# EAGLE board trig3_board_de0-nano_rack (EAGLE 9.6.2), part 1 of 2
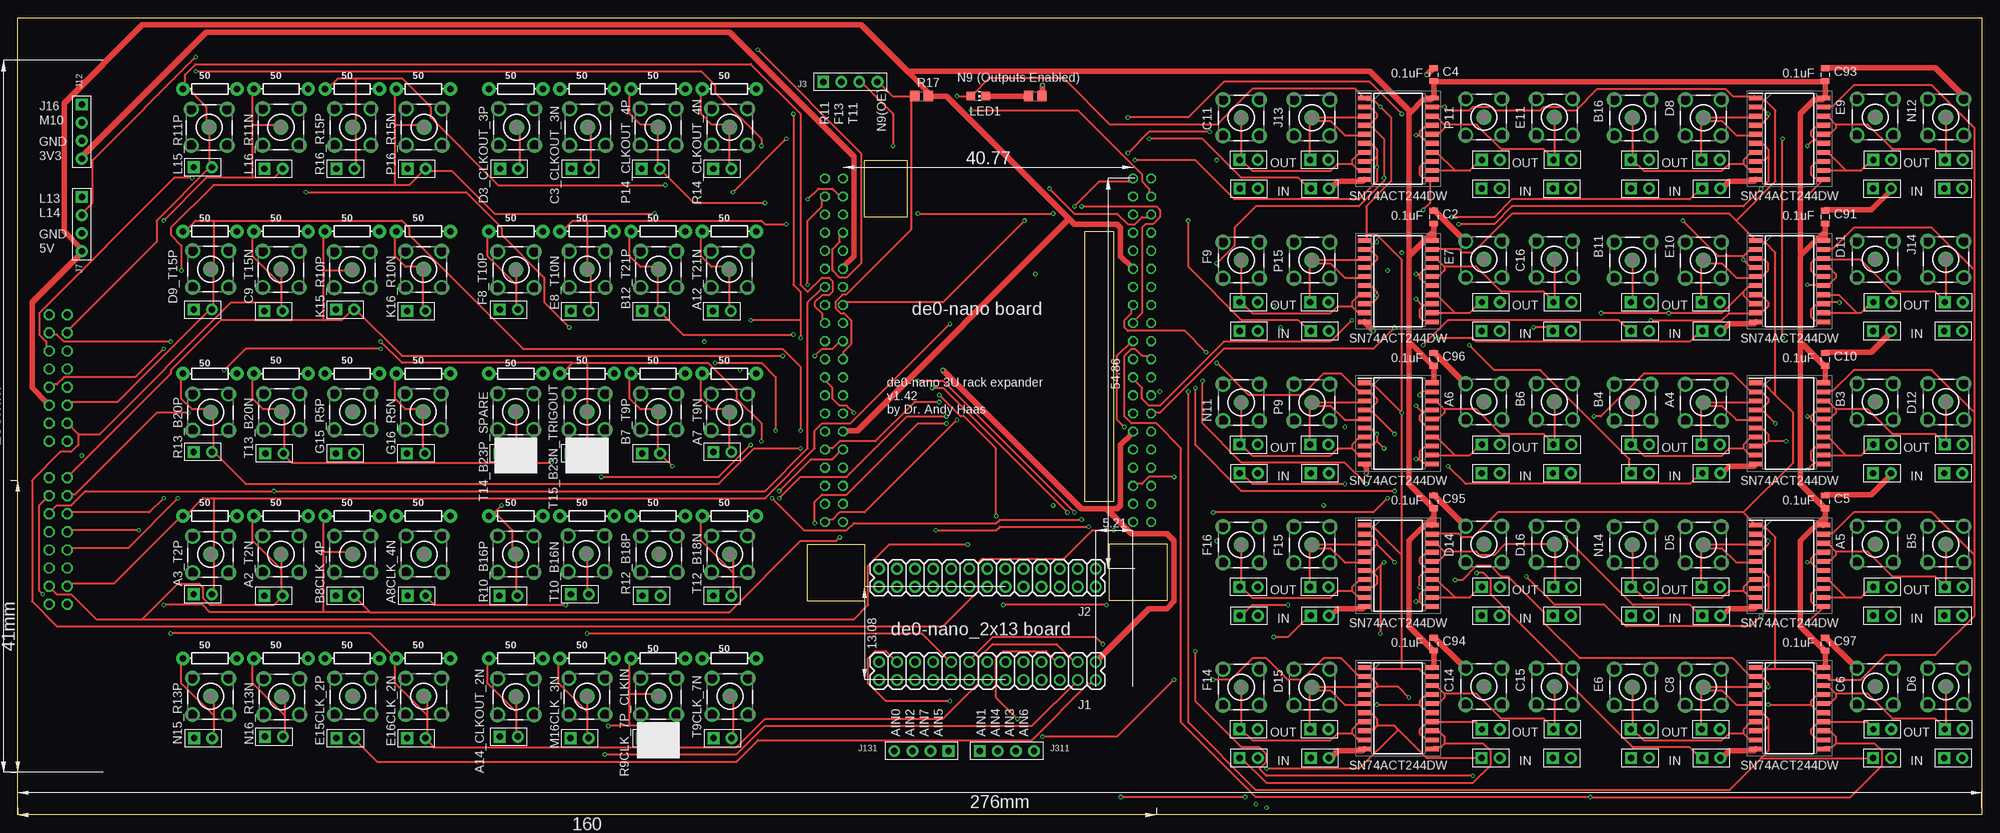
[diagram p3: board, top side]
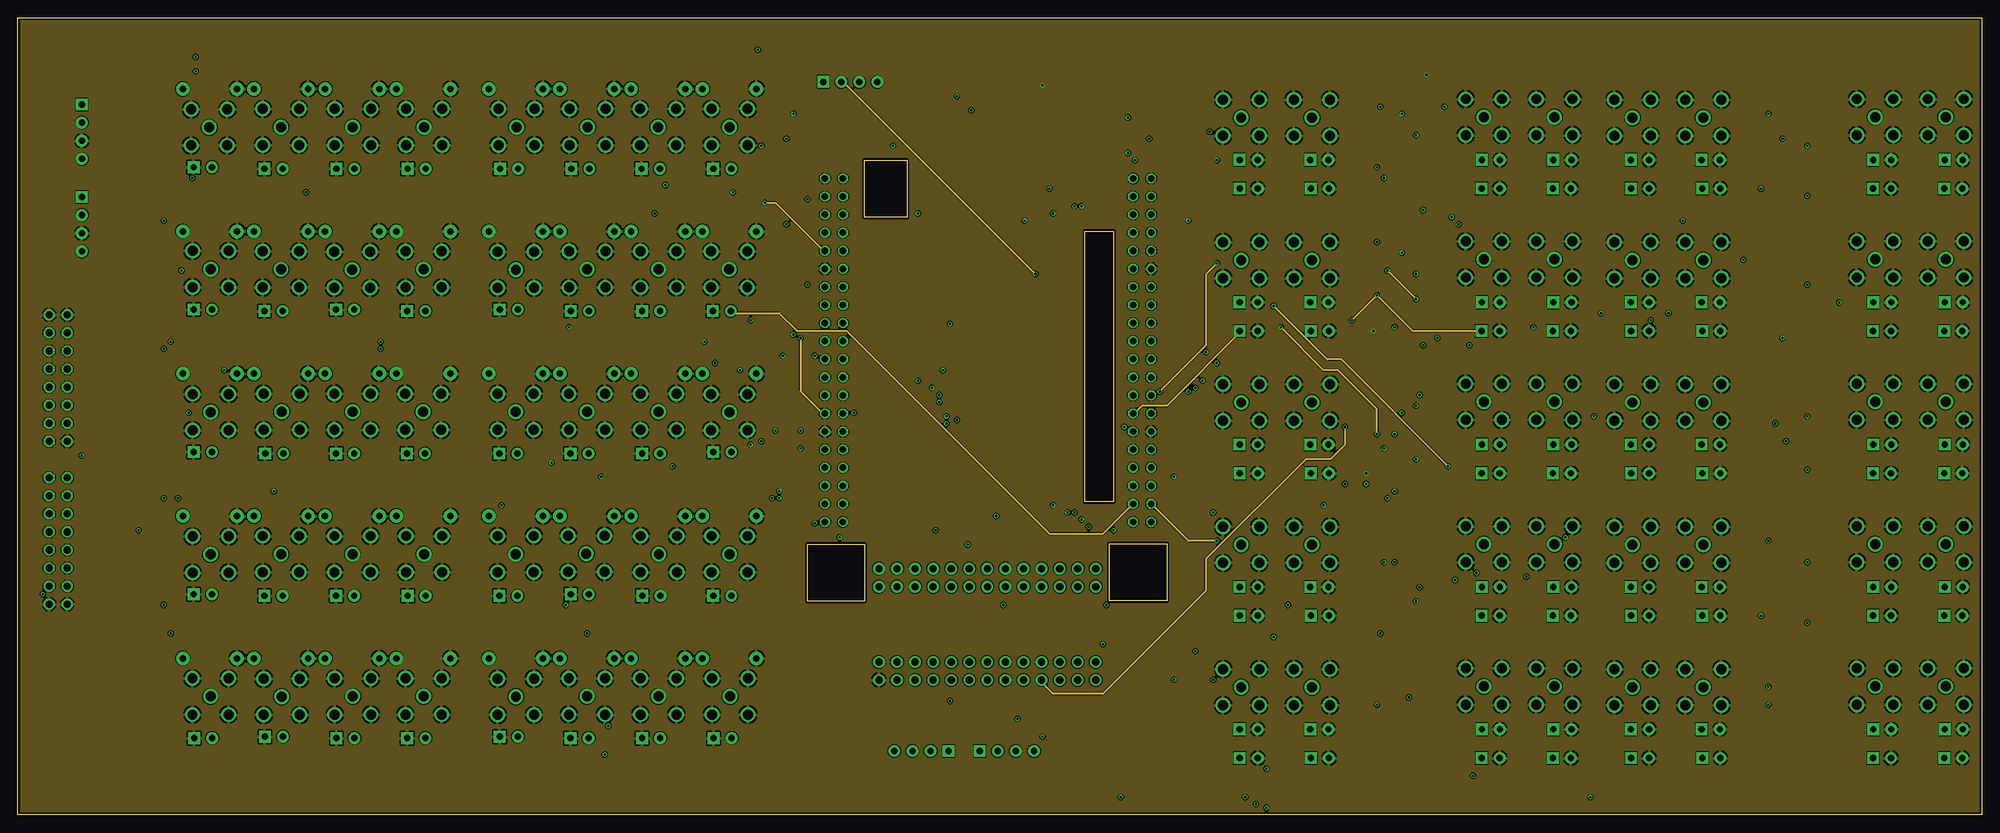
[diagram p4: board, inner layer Route2]
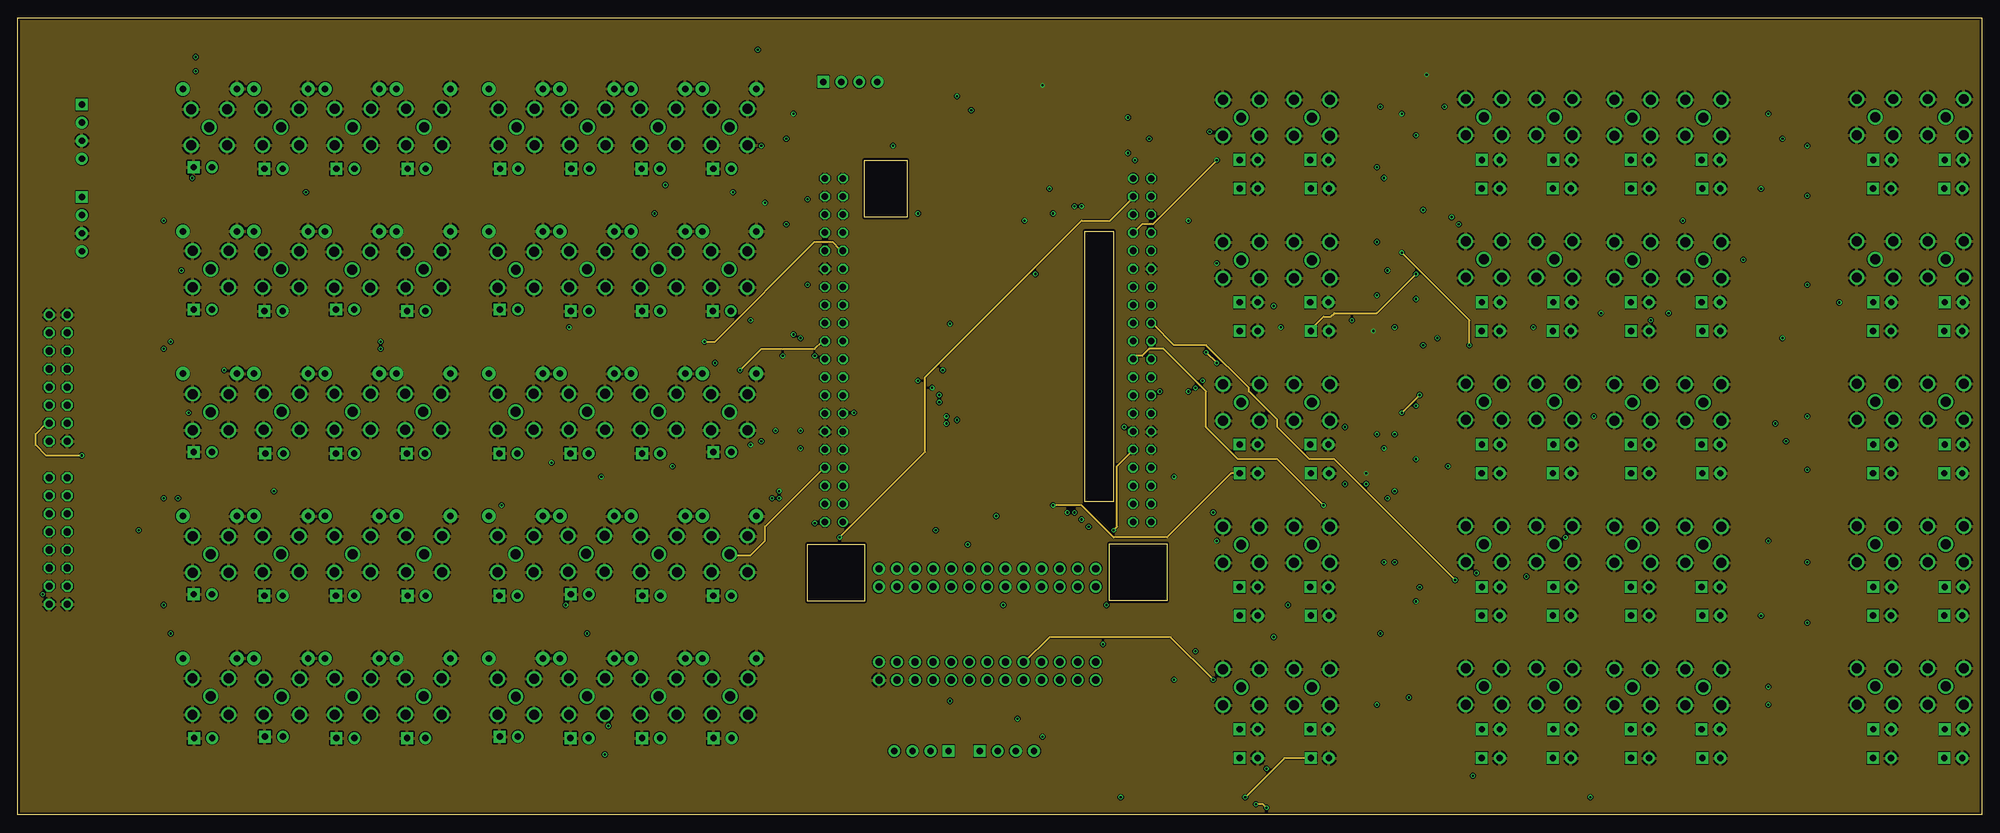
[diagram p5: board, inner layer Route15]
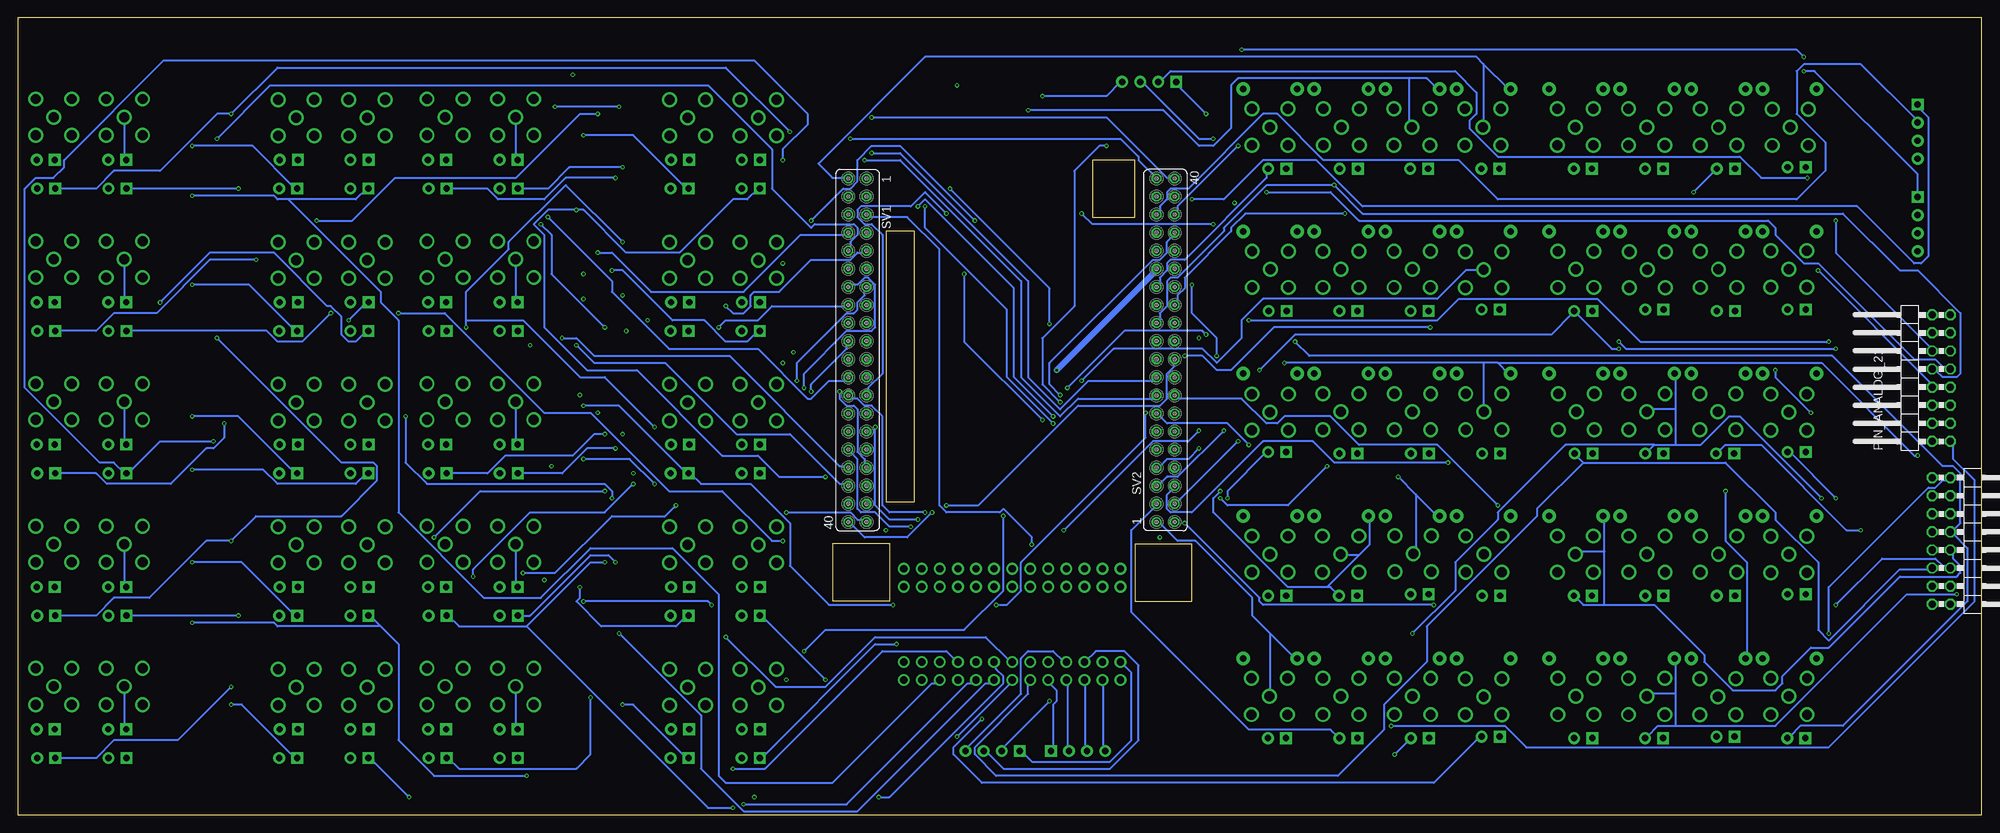
[diagram p6: board, bottom side, seen from below]

Size 276 x 112 mm. Coordinates in mm from the lower left corner, seen from the top.
Outline: 161.5,38.1 161.5,30.1 153.4,30.1 153.4,38.1 161.5,38.1
Outline: 119,38 119,30 111,30 111,38 119,38
Outline: 154,82 154,44 150,44 150,82 154,82
Outline: 119,84 119,92 125,92 125,84 119,84
Outline: 0,0 0,112 276,112 276,0 0,0
Copper layers (1*2*15*16): Top 0.035mm / dielectric 0.23mm / Route2 0.035mm / dielectric 0.93mm / Route15 0.035mm / dielectric 0.23mm / Bottom 0.035mm
Design rules "MF_Standard_4_Layer": minimum track width 5mil, minimum drill 12mil, track to track 5mil, track to pad 5mil, pad to pad 5mil, via to via 5mil, smd to smd 0mil, copper to edge 10mil, drill to drill 10mil, minimum pad ring 6mil, minimum via ring 6mil, stop-mask expansion 2mil, vias tented up to drill 25mil, thermal gap 10mil
Net classes: 0 default: width 0.254 mm; 1 power: width 0.762 mm; 3 five: width 0.381 mm; 4 50ohm: width 0.254 mm, clearance 0.254 mm to class 0, clearance 0.254 mm to class 1, clearance 0.254 mm to class 2, clearance 0.254 mm to class 3, clearance 0.254 mm

## Footprints (pad centres in the part's own frame; a part is rotated, then mirrored left to right if it is on the bottom)
BU-SMB-V = drill 1.4: 1 0,0; 2 -2.54,2.54; 3 2.54,2.54; 4 2.54,-2.54; 5 -2.54,-2.54
0805 = smd 0.8 x 1.2: 1 -0.9,0; 2 0.9,0
2X13 = drill 1.016 pad 1.651: 1 0,0; 2 0,2.54; 3 2.54,0; 4 2.54,2.54; 5 5.08,0; 6 5.08,2.54; 7 7.62,0; 8 7.62,2.54; 9 10.16,0; 10 10.16,2.54; 11 12.7,0; 12 12.7,2.54; 13 15.24,0; 14 15.24,2.54; 15 17.78,0; 16 17.78,2.54; 17 20.32,0; 18 20.32,2.54; 19 22.86,0; 20 22.86,2.54; 21 25.4,0; 22 25.4,2.54; 23 27.94,0; 24 27.94,2.54; 25 30.48,0; 26 30.48,2.54
H4-2.54 = drill 0.889 pad 1.651 square: 1 0,3.81 | drill 0.889 pad 1.651: 2 0,1.27; 3 0,-1.27; 4 0,-3.81
H2-2.54 = drill 0.889 pad 1.651 square: 1 0,1.27 | drill 0.889 pad 1.651: 2 0,-1.27
CHIP-LED0805 = smd 1.2 x 1.2: A 0,-1.05; C 0,1.05
2X08/90 = drill 1.016 octagon: 1 -8.89,-6.35; 2 -8.89,-3.81; 3 -6.35,-6.35; 4 -6.35,-3.81; 5 -3.81,-6.35; 6 -3.81,-3.81; 7 -1.27,-6.35; 8 -1.27,-3.81; 9 1.27,-6.35; 10 1.27,-3.81; 11 3.81,-6.35; 12 3.81,-3.81; 13 6.35,-6.35; 14 6.35,-3.81; 15 8.89,-6.35; 16 8.89,-3.81
AXIAL-0.3 = drill 0.9 pad 1.88: P$1 -3.81,0; P$2 3.81,0
R0805 = smd 1.3 x 1.5: 1 -0.95,0; 2 0.95,0
FE20-2 = drill 0.914: 1 -24.13,1.27 | drill 0.914 octagon: 2 -24.13,-1.27; 3 -21.59,1.27; 4 -21.59,-1.27; 5 -19.05,1.27; 6 -19.05,-1.27; 7 -16.51,1.27; 8 -16.51,-1.27; 9 -13.97,1.27; 10 -13.97,-1.27; 11 -11.43,1.27; 12 -11.43,-1.27; 13 -8.89,1.27; 14 -8.89,-1.27; 15 -6.35,1.27; 16 -6.35,-1.27; 17 -3.81,1.27; 18 -3.81,-1.27; 19 -1.27,1.27; 20 -1.27,-1.27; 21 1.27,1.27; 22 1.27,-1.27; 23 3.81,1.27; 24 3.81,-1.27; 25 6.35,1.27; 26 6.35,-1.27; 27 8.89,1.27; 28 8.89,-1.27; 29 11.43,1.27; 30 11.43,-1.27; 31 13.97,1.27; 32 13.97,-1.27; 33 16.51,1.27; 34 16.51,-1.27; 35 19.05,1.27; 36 19.05,-1.27; 37 21.59,1.27; 38 21.59,-1.27; 39 24.13,1.27; 40 24.13,-1.27
SOIC127P1030X265-20N = smd 1.95 x 0.65: 1 -4.725,5.715; 2 -4.725,4.445; 3 -4.725,3.175; 4 -4.725,1.905; 5 -4.725,0.635; 6 -4.725,-0.635; 7 -4.725,-1.905; 8 -4.725,-3.175; 9 -4.725,-4.445; 10 -4.725,-5.715; 11 4.725,-5.715; 12 4.725,-4.445; 13 4.725,-3.175; 14 4.725,-1.905; 15 4.725,-0.635; 16 4.725,0.635; 17 4.725,1.905; 18 4.725,3.175; 19 4.725,4.445; 20 4.725,5.715

## Placement (x,y rotation side)
A2_T2N  BU-SMB-V  [BU-SMB-V]  36.98,36.65 180 top
A3_T2P  BU-SMB-V  [BU-SMB-V]  27.1,36.6 180 top
A4  BU-SMB-V  [BU-SMB-V]  236.88,57.95 180 top
A5  BU-SMB-V  [BU-SMB-V]  261.02,38.05 0 top
A6  BU-SMB-V  [BU-SMB-V]  206.02,58.05 0 top
A7_T9N  BU-SMB-V  [BU-SMB-V]  100,56.6 180 top
A8CLK_4N  BU-SMB-V  [BU-SMB-V]  57.09,36.65 180 top
A12_T21N  BU-SMB-V  [BU-SMB-V]  99.98,76.65 180 top
A14_CLKOUT_2N  BU-SMB-V  [BU-SMB-V]  70,16.6 180 top
B3  BU-SMB-V  [BU-SMB-V]  261.02,58.05 0 top
B4  BU-SMB-V  [BU-SMB-V]  226.93,57.95 180 top
B5  BU-SMB-V  [BU-SMB-V]  270.96,38.05 0 top
B6  BU-SMB-V  [BU-SMB-V]  215.96,58.05 0 top
B7_T9P  BU-SMB-V  [BU-SMB-V]  90.04,56.65 180 top
B8CLK_4P  BU-SMB-V  [BU-SMB-V]  47.04,36.65 180 top
B11  BU-SMB-V  [BU-SMB-V]  226.93,77.95 180 top
B12_T21P  BU-SMB-V  [BU-SMB-V]  90.04,76.65 180 top
B16  BU-SMB-V  [BU-SMB-V]  226.93,97.95 180 top
C2  0.1uF  [0805]  199,84 270 top
C3_CLKOUT_3N  BU-SMB-V  [BU-SMB-V]  80.09,96.65 180 top
C4  0.1uF  [0805]  199,104 270 top
C5  0.1uF  [0805]  254,44 270 top
C6  BU-SMB-V  [BU-SMB-V]  261.02,18.05 0 top
C8  BU-SMB-V  [BU-SMB-V]  236.88,17.95 180 top
C9_T15N  BU-SMB-V  [BU-SMB-V]  36.98,76.65 180 top
C10  0.1uF  [0805]  254,64 270 top
C11  BU-SMB-V  [BU-SMB-V]  171.93,97.95 180 top
C14  BU-SMB-V  [BU-SMB-V]  206.02,18.05 0 top
C15  BU-SMB-V  [BU-SMB-V]  215.96,18.05 0 top
C16  BU-SMB-V  [BU-SMB-V]  215.96,78.05 0 top
C91  0.1uF  [0805]  254,84 270 top
C93  0.1uF  [0805]  254,104 270 top
C94  0.1uF  [0805]  199,24 270 top
C95  0.1uF  [0805]  199,44 270 top
C96  0.1uF  [0805]  199,64 270 top
C97  0.1uF  [0805]  254,24 270 top
D3_CLKOUT_3P  BU-SMB-V  [BU-SMB-V]  70.09,96.65 180 top
D5  BU-SMB-V  [BU-SMB-V]  236.88,37.95 180 top
D6  BU-SMB-V  [BU-SMB-V]  270.96,18.05 0 top
D8  BU-SMB-V  [BU-SMB-V]  236.88,97.95 180 top
D9_T15P  BU-SMB-V  [BU-SMB-V]  27.1,76.7 180 top
D11  BU-SMB-V  [BU-SMB-V]  261.02,78.05 0 top
D12  BU-SMB-V  [BU-SMB-V]  270.96,58.05 0 top
D14  BU-SMB-V  [BU-SMB-V]  206.02,38.05 0 top
D15  BU-SMB-V  [BU-SMB-V]  181.88,17.95 180 top
D16  BU-SMB-V  [BU-SMB-V]  215.96,38.05 0 top
E6  BU-SMB-V  [BU-SMB-V]  226.93,17.95 180 top
E7  BU-SMB-V  [BU-SMB-V]  206.02,78.05 0 top
E8_T10N  BU-SMB-V  [BU-SMB-V]  80.04,76.65 180 top
E9  BU-SMB-V  [BU-SMB-V]  261.02,98.05 0 top
E10  BU-SMB-V  [BU-SMB-V]  236.88,77.95 180 top
E11  BU-SMB-V  [BU-SMB-V]  215.96,98.05 0 top
E15CLK_2P  BU-SMB-V  [BU-SMB-V]  47.09,16.65 180 top
E16CLK_2N  BU-SMB-V  [BU-SMB-V]  57.04,16.65 180 top
F8_T10P  BU-SMB-V  [BU-SMB-V]  70,76.6 180 top
F9  BU-SMB-V  [BU-SMB-V]  171.93,77.95 180 top
F14  BU-SMB-V  [BU-SMB-V]  171.93,17.95 180 top
F15  BU-SMB-V  [BU-SMB-V]  181.88,37.95 180 top
F16  BU-SMB-V  [BU-SMB-V]  171.93,37.95 180 top
G15_R5P  BU-SMB-V  [BU-SMB-V]  47.04,56.65 180 top
G16_R5N  BU-SMB-V  [BU-SMB-V]  56.98,56.65 180 top
J1  [2X13]  151.5,21.5 180 top
J2  [2X13]  151.5,34.6 180 top
J3  4p-2.54  [H4-2.54]  117,103 90 top
J4  2p-2.54  [H2-2.54]  68.95,50.79 90 top
J5  2p-2.54  [H2-2.54]  89,10.79 90 top
J6  2p-2.54  [H2-2.54]  99.05,10.79 90 top
J7  4p-2.54  [H4-2.54]  9,83 0 top
J8  2p-2.54  [H2-2.54]  35.95,70.79 90 top
J9  2p-2.54  [H2-2.54]  99,30.79 90 top
J10  2p-2.54  [H2-2.54]  89.05,30.79 90 top
J11  2p-2.54  [H2-2.54]  26,71 90 top
J12  4p-2.54  [H4-2.54]  9,96 0 top
J13  BU-SMB-V  [BU-SMB-V]  181.88,97.95 180 top
J14  BU-SMB-V  [BU-SMB-V]  270.96,78.05 0 top
J15  2p-2.54  [H2-2.54]  56,10.79 90 top
J16  2p-2.54  [H2-2.54]  46.05,10.79 90 top
J17  2p-2.54  [H2-2.54]  26,51 90 top
J18  2p-2.54  [H2-2.54]  69,71 90 top
J22  2p-2.54  [H2-2.54]  35.95,30.79 90 top
J23  2p-2.54  [H2-2.54]  46,30.79 90 top
J24  2p-2.54  [H2-2.54]  56.05,30.79 90 top
J25  2p-2.54  [H2-2.54]  26,31 90 top
J28  2p-2.54  [H2-2.54]  55.95,50.79 90 top
J29  2p-2.54  [H2-2.54]  46,50.79 90 top
J30  2p-2.54  [H2-2.54]  79.05,90.79 90 top
J31  2p-2.54  [H2-2.54]  69,11 90 top
J32  2p-2.54  [H2-2.54]  35.95,90.79 90 top
J33  2p-2.54  [H2-2.54]  56,70.79 90 top
J34  2p-2.54  [H2-2.54]  46.05,90.79 90 top
J35  2p-2.54  [H2-2.54]  99,51 90 top
J36  2p-2.54  [H2-2.54]  98.95,70.79 90 top
J37  2p-2.54  [H2-2.54]  89,70.79 90 top
J38  2p-2.54  [H2-2.54]  36.05,50.79 90 top
J39  2p-2.54  [H2-2.54]  46,71 90 top
J40  2p-2.54  [H2-2.54]  78.95,50.79 90 top
J41  2p-2.54  [H2-2.54]  79,70.79 90 top
J42  2p-2.54  [H2-2.54]  56.05,90.79 90 top
J43  2p-2.54  [H2-2.54]  26,91 90 top
J48  2p-2.54  [H2-2.54]  68.95,30.79 90 top
J49  2p-2.54  [H2-2.54]  89,50.79 90 top
J50  2p-2.54  [H2-2.54]  69.05,90.79 90 top
J51  2p-2.54  [H2-2.54]  79,31 90 top
J52  2p-2.54  [H2-2.54]  88.95,90.79 90 top
J53  2p-2.54  [H2-2.54]  99,90.79 90 top
J54  2p-2.54  [H2-2.54]  26.05,10.79 90 top
J55  2p-2.54  [H2-2.54]  36,11 90 top
J131  4p-2.54  [H4-2.54]  127,9 270 top
J141  2p-2.54  [H2-2.54]  78.95,10.79 90 top
J311  4p-2.54  [H4-2.54]  139,9 90 top
K15_R10P  BU-SMB-V  [BU-SMB-V]  47,76.6 180 top
K16_R10N  BU-SMB-V  [BU-SMB-V]  57.04,76.65 180 top
L15_R11P  BU-SMB-V  [BU-SMB-V]  26.9,96.6 180 top
L16_R11N  BU-SMB-V  [BU-SMB-V]  36.98,96.65 180 top
LED1  red  [CHIP-LED0805]  135,101 270 top
M16CLK_3N  BU-SMB-V  [BU-SMB-V]  79.98,16.65 180 top
N11  BU-SMB-V  [BU-SMB-V]  171.93,57.95 180 top
N12  BU-SMB-V  [BU-SMB-V]  270.96,98.05 0 top
N14  BU-SMB-V  [BU-SMB-V]  226.93,37.95 180 top
N15_R13P  BU-SMB-V  [BU-SMB-V]  27.09,16.65 180 top
N16_R13N  BU-SMB-V  [BU-SMB-V]  37.1,16.6 180 top
OJ1  2p-2.54  [H2-2.54]  272.07,72.04 90 top
OJ2  2p-2.54  [H2-2.54]  262.02,72.04 90 top
OJ3  2p-2.54  [H2-2.54]  227.97,72.04 90 top
OJ4  2p-2.54  [H2-2.54]  237.92,72.04 90 top
OJ5  2p-2.54  [H2-2.54]  238,68 90 top
OJ6  2p-2.54  [H2-2.54]  228,68 90 top
OJ7  2p-2.54  [H2-2.54]  272,68 90 top
OJ8  2p-2.54  [H2-2.54]  262,68 90 top
OJ17  2p-2.54  [H2-2.54]  237.92,92.04 90 top
OJ18  2p-2.54  [H2-2.54]  227.97,92.04 90 top
OJ19  2p-2.54  [H2-2.54]  262.02,92.04 90 top
OJ20  2p-2.54  [H2-2.54]  272.07,92.04 90 top
OJ21  2p-2.54  [H2-2.54]  238,88 90 top
OJ22  2p-2.54  [H2-2.54]  228,88 90 top
OJ23  2p-2.54  [H2-2.54]  272,88 90 top
OJ24  2p-2.54  [H2-2.54]  262,88 90 top
OJ25  2p-2.54  [H2-2.54]  182.92,12.04 90 top
OJ26  2p-2.54  [H2-2.54]  172.97,12.04 90 top
OJ27  2p-2.54  [H2-2.54]  207.02,12.04 90 top
OJ28  2p-2.54  [H2-2.54]  217.07,12.04 90 top
OJ29  2p-2.54  [H2-2.54]  183,8 90 top
OJ30  2p-2.54  [H2-2.54]  173,8 90 top
OJ31  2p-2.54  [H2-2.54]  217,8 90 top
OJ32  2p-2.54  [H2-2.54]  207,8 90 top
OJ33  2p-2.54  [H2-2.54]  182.92,32.04 90 top
OJ34  2p-2.54  [H2-2.54]  172.97,32.04 90 top
OJ35  2p-2.54  [H2-2.54]  207.02,32.04 90 top
OJ36  2p-2.54  [H2-2.54]  217.07,32.04 90 top
OJ37  2p-2.54  [H2-2.54]  183,28 90 top
OJ38  2p-2.54  [H2-2.54]  173,28 90 top
OJ39  2p-2.54  [H2-2.54]  217,28 90 top
OJ40  2p-2.54  [H2-2.54]  207,28 90 top
OJ41  2p-2.54  [H2-2.54]  182.92,52.04 90 top
OJ42  2p-2.54  [H2-2.54]  172.97,52.04 90 top
OJ43  2p-2.54  [H2-2.54]  207.02,52.04 90 top
OJ44  2p-2.54  [H2-2.54]  217.07,52.04 90 top
OJ45  2p-2.54  [H2-2.54]  183,48 90 top
OJ46  2p-2.54  [H2-2.54]  173,48 90 top
OJ47  2p-2.54  [H2-2.54]  217,48 90 top
OJ48  2p-2.54  [H2-2.54]  207,48 90 top
OJ49  2p-2.54  [H2-2.54]  237.92,12.04 90 top
OJ50  2p-2.54  [H2-2.54]  227.97,12.04 90 top
OJ51  2p-2.54  [H2-2.54]  262.02,12.04 90 top
OJ52  2p-2.54  [H2-2.54]  272.07,12.04 90 top
OJ53  2p-2.54  [H2-2.54]  238,8 90 top
OJ54  2p-2.54  [H2-2.54]  228,8 90 top
OJ55  2p-2.54  [H2-2.54]  272,8 90 top
OJ56  2p-2.54  [H2-2.54]  262,8 90 top
OJ57  2p-2.54  [H2-2.54]  182.92,72.04 90 top
OJ58  2p-2.54  [H2-2.54]  172.97,72.04 90 top
OJ59  2p-2.54  [H2-2.54]  207.02,72.04 90 top
OJ60  2p-2.54  [H2-2.54]  217.07,72.04 90 top
OJ61  2p-2.54  [H2-2.54]  183,68 90 top
OJ62  2p-2.54  [H2-2.54]  173,68 90 top
OJ63  2p-2.54  [H2-2.54]  217,68 90 top
OJ64  2p-2.54  [H2-2.54]  207,68 90 top
OJ65  2p-2.54  [H2-2.54]  237.92,32.04 90 top
OJ66  2p-2.54  [H2-2.54]  227.97,32.04 90 top
OJ67  2p-2.54  [H2-2.54]  262.02,32.04 90 top
OJ68  2p-2.54  [H2-2.54]  272.07,32.04 90 top
OJ69  2p-2.54  [H2-2.54]  238,28 90 top
OJ70  2p-2.54  [H2-2.54]  228,28 90 top
OJ71  2p-2.54  [H2-2.54]  272,28 90 top
OJ72  2p-2.54  [H2-2.54]  262,28 90 top
OJ73  2p-2.54  [H2-2.54]  182.92,92.04 90 top
OJ74  2p-2.54  [H2-2.54]  172.97,92.04 90 top
OJ75  2p-2.54  [H2-2.54]  207.02,92.04 90 top
OJ76  2p-2.54  [H2-2.54]  217.07,92.04 90 top
OJ77  2p-2.54  [H2-2.54]  183,88 90 top
OJ78  2p-2.54  [H2-2.54]  173,88 90 top
OJ79  2p-2.54  [H2-2.54]  217,88 90 top
OJ80  2p-2.54  [H2-2.54]  207,88 90 top
OJ89  2p-2.54  [H2-2.54]  237.92,52.04 90 top
OJ90  2p-2.54  [H2-2.54]  227.97,52.04 90 top
OJ91  2p-2.54  [H2-2.54]  262.02,52.04 90 top
OJ92  2p-2.54  [H2-2.54]  272.07,52.04 90 top
OJ93  2p-2.54  [H2-2.54]  238,48 90 top
OJ94  2p-2.54  [H2-2.54]  228,48 90 top
OJ95  2p-2.54  [H2-2.54]  272,48 90 top
OJ96  2p-2.54  [H2-2.54]  262,48 90 top
P9  BU-SMB-V  [BU-SMB-V]  181.88,57.95 180 top
P11  BU-SMB-V  [BU-SMB-V]  206.02,98.05 0 top
P14_CLKOUT_4P  BU-SMB-V  [BU-SMB-V]  89.98,96.65 180 top
P15  BU-SMB-V  [BU-SMB-V]  181.88,77.95 180 top
P16_R15N  BU-SMB-V  [BU-SMB-V]  57.09,96.65 180 top
PIN_AIN_PWRGND21  15-91-2160  [2X08/90]  0.6,38.5 270 bottom
PIN_ANALOG_21  15-91-2160  [2X08/90]  10.76,61.38 90 bottom
R4  50  [AXIAL-0.3]  70,62 180 top
R5  50  [AXIAL-0.3]  90,22 180 top
R6  50  [AXIAL-0.3]  100,22 180 top
R8  560  [R0805]  143,101 0 top
R9  50  [AXIAL-0.3]  100,82 180 top
R9CLK_7P_CLKIN  BU-SMB-V  [BU-SMB-V]  90.04,16.65 180 top
R10_B16P  BU-SMB-V  [BU-SMB-V]  69.98,36.65 180 top
R11  50  [AXIAL-0.3]  90,82 180 top
R12_B18P  BU-SMB-V  [BU-SMB-V]  90.09,36.65 180 top
R13_B20P  BU-SMB-V  [BU-SMB-V]  27.1,56.6 180 top
R14_CLKOUT_4N  BU-SMB-V  [BU-SMB-V]  100.04,96.65 180 top
R15  50  [AXIAL-0.3]  80,22 180 top
R16_R15P  BU-SMB-V  [BU-SMB-V]  47.09,96.65 180 top
R17  10k  [R0805]  127,101 0 top
R18  50  [AXIAL-0.3]  57,22 180 top
R19  50  [AXIAL-0.3]  47,22 180 top
R20  50  [AXIAL-0.3]  37,42 180 top
R21  50  [AXIAL-0.3]  70,82 180 top
R22  50  [AXIAL-0.3]  47,42 180 top
R23  50  [AXIAL-0.3]  57,42 180 top
R24  50  [AXIAL-0.3]  57,62 180 top
R25  50  [AXIAL-0.3]  27,42 180 top
R26  50  [AXIAL-0.3]  47,62 180 top
R27  50  [AXIAL-0.3]  80,102 180 top
R28  50  [AXIAL-0.3]  37,102 180 top
R29  50  [AXIAL-0.3]  70,22 180 top
R30  50  [AXIAL-0.3]  57,82 180 top
R31  50  [AXIAL-0.3]  47,102 180 top
R32  50  [AXIAL-0.3]  37,62 180 top
R33  50  [AXIAL-0.3]  100,62 180 top
R35  50  [AXIAL-0.3]  47,82 180 top
R39  50  [AXIAL-0.3]  80,62 180 top
R40  50  [AXIAL-0.3]  80,82 180 top
R41  50  [AXIAL-0.3]  57,102 180 top
R43  50  [AXIAL-0.3]  27,102 180 top
R45  50  [AXIAL-0.3]  90,102 180 top
R46  50  [AXIAL-0.3]  100,102 180 top
R47  50  [AXIAL-0.3]  27,22 180 top
R49  50  [AXIAL-0.3]  70,42 180 top
R50  50  [AXIAL-0.3]  90,62 180 top
R51  50  [AXIAL-0.3]  70,102 180 top
R52  50  [AXIAL-0.3]  37,22 180 top
R53  50  [AXIAL-0.3]  80,42 180 top
R91  50  [AXIAL-0.3]  37,82 180 top
R100  50  [AXIAL-0.3]  100,42 180 top
R111  50  [AXIAL-0.3]  90,42 180 top
R141  50  [AXIAL-0.3]  27,82 180 top
R161  50  [AXIAL-0.3]  27,62 180 top
SV1  [FE20-2]  158,65.3 270 bottom
SV2  [FE20-2]  114.7,65.3 90 bottom
T9CLK_7N  BU-SMB-V  [BU-SMB-V]  100.09,16.65 180 top
T10_B16N  BU-SMB-V  [BU-SMB-V]  79.9,36.7 180 top
T12_B18N  BU-SMB-V  [BU-SMB-V]  100.04,36.65 180 top
T13_B20N  BU-SMB-V  [BU-SMB-V]  37.09,56.65 180 top
T14_B23P_SPARE  BU-SMB-V  [BU-SMB-V]  69.98,56.65 180 top
T15_B23N_TRIGOUT  BU-SMB-V  [BU-SMB-V]  79.98,56.65 180 top
VSLUE  SN74ACT244DW  [SOIC127P1030X265-20N]  249,75 0 top
VSLUE2  SN74ACT244DW  [SOIC127P1030X265-20N]  249,95 0 top
VSLUE3  SN74ACT244DW  [SOIC127P1030X265-20N]  194,15 0 top
VSLUE4  SN74ACT244DW  [SOIC127P1030X265-20N]  194,35 0 top
VSLUE5  SN74ACT244DW  [SOIC127P1030X265-20N]  194,55 0 top
VSLUE6  SN74ACT244DW  [SOIC127P1030X265-20N]  249,15 0 top
VSLUE7  SN74ACT244DW  [SOIC127P1030X265-20N]  194,75 0 top
VSLUE8  SN74ACT244DW  [SOIC127P1030X265-20N]  249,35 0 top
VSLUE9  SN74ACT244DW  [SOIC127P1030X265-20N]  194,95 0 top
VSLUE11  SN74ACT244DW  [SOIC127P1030X265-20N]  249,55 0 top